# EAGLE design SMD (EAGLE 7.6.0)
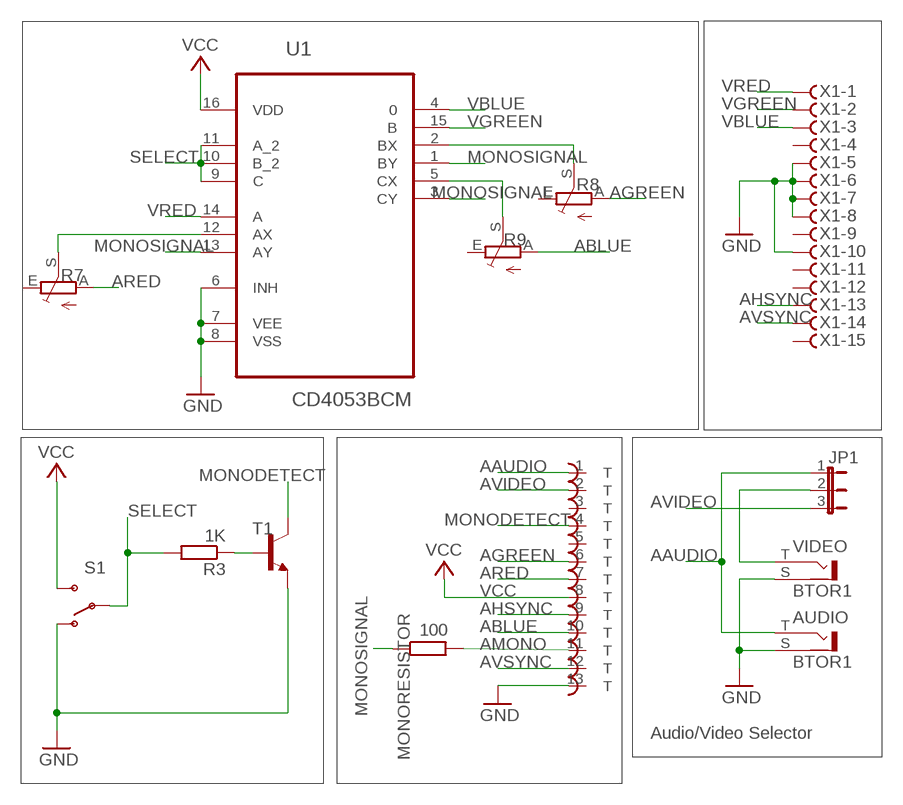
[diagram p0: schematic, sheet 1]

## Parts
ATARIOUT  DIN13T  [ADADS]
AUDIO  BTOR1  [BTOR1]
JP1  JP2E  [JP2]
MONORESISTOR  100  R-EU_0207/2V  [0207/2V]
R3  1K  R-EU_M1206  [M1206]
R7  TRIM_EU-CA6H  [CA6H]
R8  TRIM_EU-CA6H  [CA6H]
R9  TRIM_EU-CA6H  [CA6H]
S1  SWITCH-SPDT-SMD-A  [SWITCH-SPST-SMD-A]
T1  MMBT3904LT1-NPN-SOT23-BEC  [SOT23-BEC]
U1  CD4053BCM  [SOIC127P600X175-16N]
VIDEO  BTOR1  [BTOR1]
X1  F15HDVS  [HDF15V]

## Nets
AAUDIO: ATARIOUT.1 AUDIO.T JP1.1
ABLUE: ATARIOUT.10 R9.A
AGREEN: ATARIOUT.6 R8.A
AHSYNC: ATARIOUT.9 X1.13
AMONO: ATARIOUT.11 MONORESISTOR.2
ARED: ATARIOUT.7 R7.A
AVIDEO: ATARIOUT.2 JP1.3
AVSYNC: ATARIOUT.12 X1.14
GND: ATARIOUT.13 AUDIO.S S1.1(O) T1.E U1.6(INH) U1.7(VEE) U1.8(VSS) VIDEO.S X1.5 X1.6 X1.7 X1.8 X1.10
MONODETECT: ATARIOUT.4 T1.C
MONOSIGNAL: MONORESISTOR.1 U1.1(BY) U1.3(CY) U1.13(AY)
N$2: R7.S U1.12(AX)
N$3: JP1.2 VIDEO.T
N$4: R8.S U1.2(BX)
N$5: R9.S U1.5(CX)
N$7: R3.1 T1.B
SELECT: R3.2 S1.2(P) U1.9(C) U1.10(B_2) U1.11(A_2)
VBLUE: U1.4 X1.3
VCC: ATARIOUT.8 S1.3(S) U1.16(VDD)
VGREEN: U1.15(B) X1.2
VRED: U1.14(A) X1.1
Unconnected: ATARIOUT.3 ATARIOUT.5 AUDIO.S@1 AUDIO.S@2 AUDIO.S@3 R7.E R8.E R9.E VIDEO.S@1 VIDEO.S@2 VIDEO.S@3 X1.4 X1.9 X1.11 X1.12 X1.15

## Notes on the sheet
- Audio/Video Selector

## Library data of the parts
ATARIOUT = ube:DIN13
AUDIO VIDEO = con-lumberg:BTOR1: RCA connectors according to JEITA RC-5231 Cinch RCA-Einbaukupplung nach JEITA RC-5231, stehende Ausführung Source: http://www.lumberg.de/Produkte/PDFs/BTOR1.pdf; OC_FARNELL: 1217030; OC_NEWARK: unknown
JP1 = jumper:JP2E: JUMPER
MONORESISTOR R3 = rcl:R-EU_: RESISTOR, European symbol
R7-R9 = pot:TRIM_EU-: POTENTIOMETER
S1 = SparkFun-Electromechanical:SWITCH-SPDT: SPDT Switch Simple slide switch, Spark Fun Electronics SKU : COM-00102 DPDT SMT slide switch, AYZ0202, SWCH-08179; PROD_ID: SWCH-10651
T1 = transistor-neu-to92:*-NPN-: NPN Transistror
U1 = Fairchild_By_element14_Batch_1:CD4053BCM: Analog Multiplexer/Demultiplexer; MPN: CD4053BCM; OC_FARNELL: 1014064; OC_NEWARK: 79K4321; PACKAGE: SOIC-16; SUPPLIER: Fairchild
X1 = con-subd:F15?S: SUB-D; OC_FARNELL: unknown; OC_NEWARK: unknown

## Net classes
0 default: width 0.254 mm

## Board
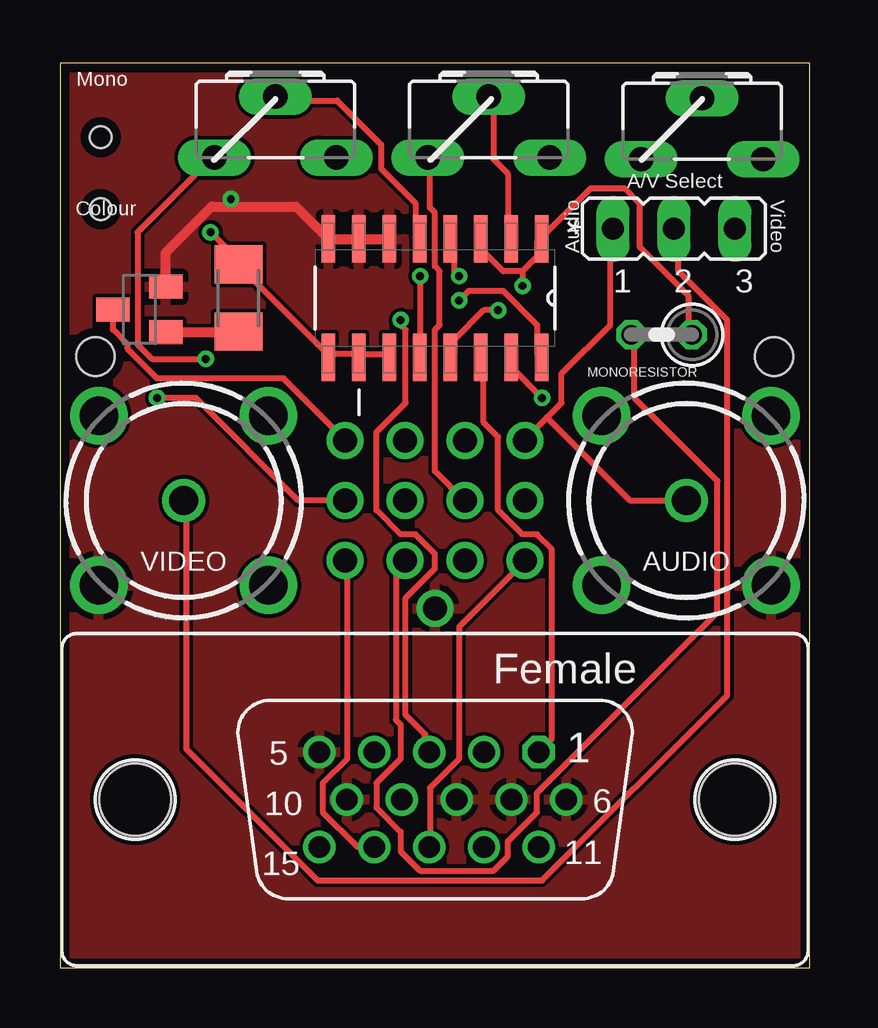
[diagram p1: board, top side]
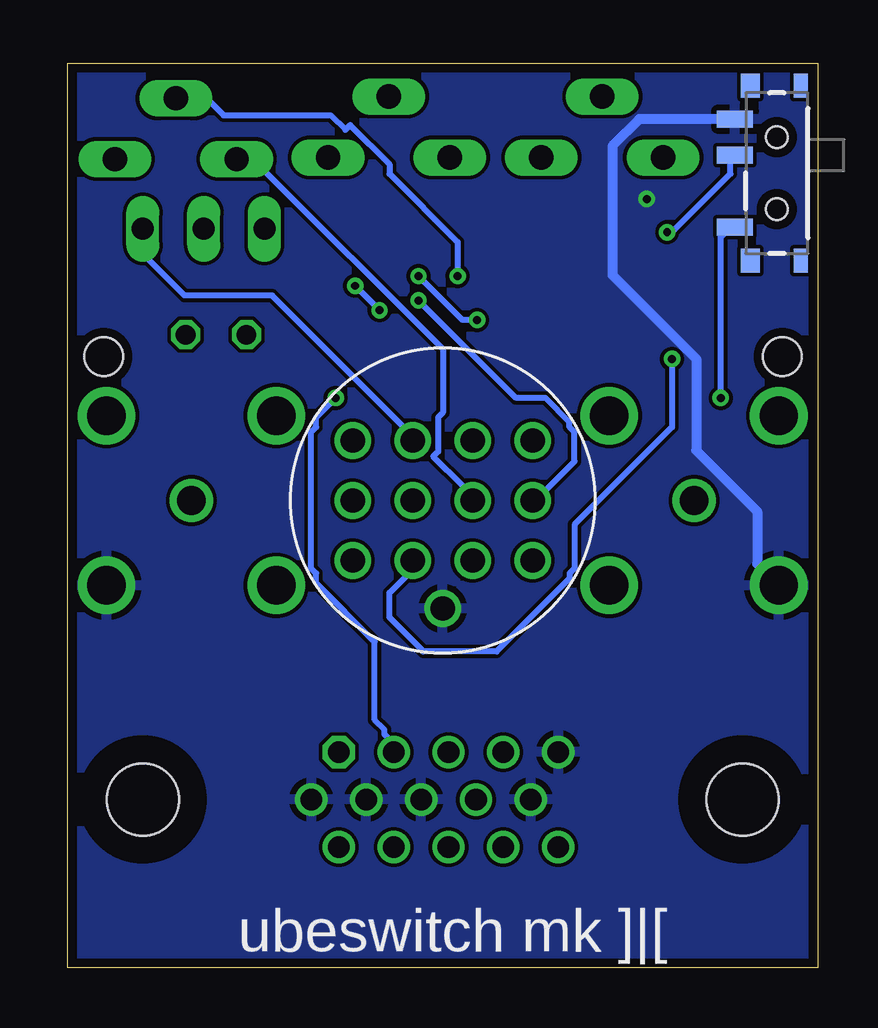
[diagram p2: board, bottom side, seen from below]

Size 31.27 x 37.7 mm. Coordinates in mm from the lower left corner, seen from the top.
Outline: 0,0 31.27,0 31.27,37.7 0,37.7 0,0
Copper layers (1*16): Top 0.0356mm / dielectric 1.5011mm / Bottom 0.0356mm
Design rules "PCBs_io": minimum track width 6mil, minimum drill 13mil, track to track 6mil, track to pad 6mil, pad to pad 6mil, via to via 6mil, smd to smd 6mil, copper to edge 15mil, drill to drill 6mil, minimum pad ring 7mil, minimum via ring 7mil, stop-mask expansion 3mil, vias tented up to drill 0mil, thermal gap 10mil
Holes 1.6 mm at 1.48,25.47 29.77,25.47

### Footprints (pad centres in the part's own frame; a part is rotated, then mirrored left to right if it is on the bottom)
ADADS = drill 1.016: 1 -3.75,2.5; 2 -1.25,2.5; 3 1.25,2.5; 4 3.75,2.5; 5 -3.75,0; 6 -1.25,0; 7 1.25,0; 8 3.75,0; 9 -3.75,-2.5; 10 -1.25,-2.5; 11 1.25,-2.5; 12 3.75,-2.5; 13 0,-4.5
BTOR1 = drill 1.6 pad 2.2: S -5,0; S@1 0,5; S@2 5,0; S@3 0,-5 | drill 1.2 pad 1.6: T 0,0
JP2 = drill 0.914 long: 1 -2.54,0; 2 0,0; 3 2.54,0
0207/2V = drill 0.813 octagon: 1 -1.27,0; 2 1.27,0
M1206 = smd 1.6 x 2: 1 -1.4,0; 2 1.4,0
CA6H = drill 1.016 long: A -2.54,0; E 2.54,0; S 0,2.54
SWITCH-SPST-SMD-A = smd 0.7 x 1.5: 1 -2.25,-1.75; 2 -0.75,-1.75; 3 2.25,-1.75 | smd 1 x 0.6: GND1 -3.65,1; GND3 3.65,1 | smd 1 x 0.8: GND2 -3.65,-1.1; GND4 3.65,-1.1 | hole 0.9: -1.5,0; 1.5,0
SOT23-BEC = smd 1 x 1.4: B -0.95,-1.1; C 0,1.1; E 0.95,-1.1
SOIC127P600X175-16N = smd 1.981 x 0.559: 1 -2.464,4.445; 2 -2.464,3.175; 3 -2.464,1.905; 4 -2.464,0.635; 5 -2.464,-0.635; 6 -2.464,-1.905; 7 -2.464,-3.175; 8 -2.464,-4.445; 9 2.464,-4.445; 10 2.464,-3.175; 11 2.464,-1.905; 12 2.464,-0.635; 13 2.464,0.635; 14 2.464,1.905; 15 2.464,3.175; 16 2.464,4.445
HDF15V = drill 0.9 octagon: 1 4.329,1.98 | drill 0.9: 2 2.043,1.98; 3 -0.243,1.98; 4 -2.529,1.98; 5 -4.815,1.98; 6 5.472,0; 7 3.186,0; 8 0.9,0; 9 -1.386,0; 10 -3.672,0; 11 4.329,-1.98; 12 2.043,-1.98; 13 -0.243,-1.98; 14 -2.529,-1.98; 15 -4.815,-1.98 | hole 3: -12.5,0; 12.5,0

### Placement (x,y rotation side)
ATARIOUT  15.63,19.47 0 bottom
AUDIO  26.11,19.47 135 top
JP1  25.6,30.8 0 top
MONORESISTOR  25.08,26.38 180 top
R3  7.44,27.91 90 top
R7  26.76,33.7 0 top
R8  17.87,33.77 0 top
R9  8.98,33.77 0 top
S1  1.7,33.12 270 bottom
T1  3.31,27.43 90 top
U1  15.63,27.91 270 top
VIDEO  5.16,19.47 45 top
X1  15.63,7 0 top

### Tracks (layer width: path | path; a pad name or v marks a point on that pad's centre or on a via)
AAUDIO
  Top 0.254: 20.3,22.93 19.49,22.12 ATARIOUT.1 | 20.3,22.93 20.91,23.54 20.91,24.76 22.94,26.79 22.94,30.65 JP1.1 | 20.3,22.93 23.75,19.48 25.99,19.48 AUDIO.T
ABLUE  (via drill 0.33)
  Top 0.254: v6.08,25.37 3.84,25.37 3.23,25.98 3.23,30.65 6.28,33.7 R9.A
  Bottom 0.254: v6.08,25.37 6.08,22.52 10.14,18.46 10.14,16.63 10.34,16.43 10.34,16.23 13.39,13.18 16.44,13.18 17.86,14.6 17.86,15.62 17.05,16.43 17.05,16.84 ATARIOUT.10
AGREEN
  Top 0.254: R8.A 15.42,33.7 15.42,31.67 15.63,31.47 15.63,29.23 15.83,29.03 15.83,26.79 15.63,26.59 15.63,20.7 16.85,19.48 ATARIOUT.6
AHSYNC
  Top 0.254: X1.13 15.42,5.05 15.42,7.49 16.64,8.71 16.64,14.19 19.28,16.84 ATARIOUT.9
AMONO
  Top 0.254: MONORESISTOR.2 23.96,26.18 23.96,23.74 27.41,20.29 27.41,14.8 19.89,7.29 19.89,6.47 18.67,5.25 18.67,4.64 18.07,4.03 15.02,4.03 14.2,4.85 14.2,5.66 13.19,6.68 13.19,7.69 14.2,8.71 14.2,10.13 14,10.33 14,16.63 14.2,16.84 ATARIOUT.11
ARED
  Bottom 0.254: ATARIOUT.7 14.41,19.48 14.81,19.88 14.81,20.09 16.03,21.31 15.83,21.51 15.83,22.93 15.63,23.13 15.63,25.78 23.35,33.5 24.16,33.5 R7.A
AVIDEO
  Bottom 0.254: JP1.3 28.02,30.65 28.02,29.64 26.4,28.01 22.74,28.01 16.85,22.12 ATARIOUT.2
AVSYNC
  Top 0.254: X1.14 12.99,5.05 12.38,5.05 10.95,6.47 10.95,7.69 11.97,8.71 11.97,16.84 ATARIOUT.12
GND  (via drill 0.33)
  Top 0.406: T1.E 4.41,29.8 6.33,31.72 9.84,31.72 U1.8 U1.7 U1.6
  Bottom 0.406: S1.1 7.45,35.37 8.55,34.26 8.55,28.86 5.06,25.37 5.06,21.56 2.52,19.02 2.52,16.83 VIDEO.S
  other vias: 7.12,32.04
  pour Top: -0.02,-0.03 -0.02,39.34 31.73,39.34 31.73,-0.03
  pour Bottom: -0.02,39.34 31.73,39.34 31.73,-0.03 -0.02,-0.03
MONODETECT
  Top 0.254: T1.C 2.21,27.4 2.21,26.59 2.83,25.98 2.83,25.78 4.04,24.56 9.33,24.56 11.77,22.12 ATARIOUT.4
MONOSIGNAL  (via drill 0.33)
  Top 0.254: v18.27,27.4 17.66,27.4 16.44,26.18 16.44,25.57 U1.13 | 19.28,29.03 v19.28,28.42 | 19.28,29.03 19.89,29.64 19.89,30.25 U1.1 20.1,30.45 22.13,32.48 23.55,32.48 24.16,31.87 24.16,30.04 26.19,28.01 26.19,26.39 MONORESISTOR.1 | 19.28,29.03 18.47,29.03 17.66,29.84 17.66,30.25 U1.3
  Bottom 0.254: v19.28,28.42 v18.27,27.4
N$2  (via drill 0.33)
  Top 0.254: v15.02,28.82 15.02,25.57 U1.12
  Bottom 0.254: v15.02,28.82 15.02,30.25 17.86,33.09 17.86,33.5 19.49,35.12 19.69,34.92 20.3,35.53 24.77,35.53 25.38,36.14 26.6,36.14 R7.S
N$3
  Top 0.254: JP1.2 25.79,30.65 25.79,29.03 27.82,27 27.82,11.35 20.1,3.63 10.75,3.63 5.26,9.11 5.26,19.27 VIDEO.T
N$4
  Top 0.254: U1.2 18.67,30.45 18.67,33.09 18.07,33.7 18.07,36.14 R8.S
N$5
  Top 0.254: U1.5 14.81,30.45 14.81,31.87 13.39,33.3 13.39,34.31 11.56,36.14 9.12,36.14 R9.S
N$7
  Top 0.406: T1.B 7.42,26.48 R3.1
SELECT  (via drill 0.33)
  Top 0.254: U1.11 13.59,25.57 12.58,25.57 U1.10 12.38,25.57 11.36,25.57 U1.9 11.16,25.57 7.5,29.23 R3.2 7.5,29.43 v6.28,30.65
  Bottom 0.254: v6.28,30.65 6.08,30.65 3.64,33.09 3.64,33.7 S1.2
VBLUE  (via drill 0.33)
  Top 0.254: v16.64,28.82 16.44,29.03 16.44,30.25 U1.4 | v14.2,27 14.2,26.79 14.41,26.59 14.41,23.54 13.19,22.32 13.19,19.07 14.2,18.05 14.81,18.05 15.63,17.24 15.63,16.63 14.41,15.41 14.41,10.54 15.22,9.72 15.22,9.11 X1.3
  Bottom 0.254: v16.64,28.82 14.81,27 v14.2,27
VCC  (via drill 0.33)
  Top 0.254: v4.04,23.74 5.67,23.74 9.94,19.48 11.77,19.48 ATARIOUT.8 | v16.64,27.81 17.05,28.21 18.47,28.21 19.89,26.79 19.89,25.57 U1.16
  Bottom 0.254: v4.04,23.74 4.04,30.45 3.64,30.86 S1.3 | v16.64,27.81 12.58,23.74 11.36,23.74 10.34,22.73 10.34,22.52 10.14,22.32 10.14,21.1 11.77,19.48 ATARIOUT.8
VGREEN  (via drill 0.33)
  Top 0.254: v20.1,23.74 18.88,24.96 18.88,25.37 U1.15
  Bottom 0.254: v20.1,23.74 20.91,22.93 20.91,22.52 21.11,22.32 21.11,16.63 20.91,16.43 20.91,16.02 18.47,13.58 18.47,10.33 18.07,9.93 18.07,9.72 17.86,9.52 17.86,9.11 X1.2
VRED
  Top 0.254: U1.14 17.66,25.37 17.66,22.73 18.27,22.12 18.27,19.07 19.28,18.05 19.89,18.05 20.5,17.45 20.5,9.52 20.1,9.11 X1.1

### Text on the board
tNames: Mono | A/V Select | Colour | Audio | Video
bNames: ubeswitch mk ]|[
Document: Distance from PCB to surface. | Distance from PIN13 to bottom of case. | Distance from PIN13 to surface.